# Altium schematic sheet Heater 020305.SchDoc
size A4
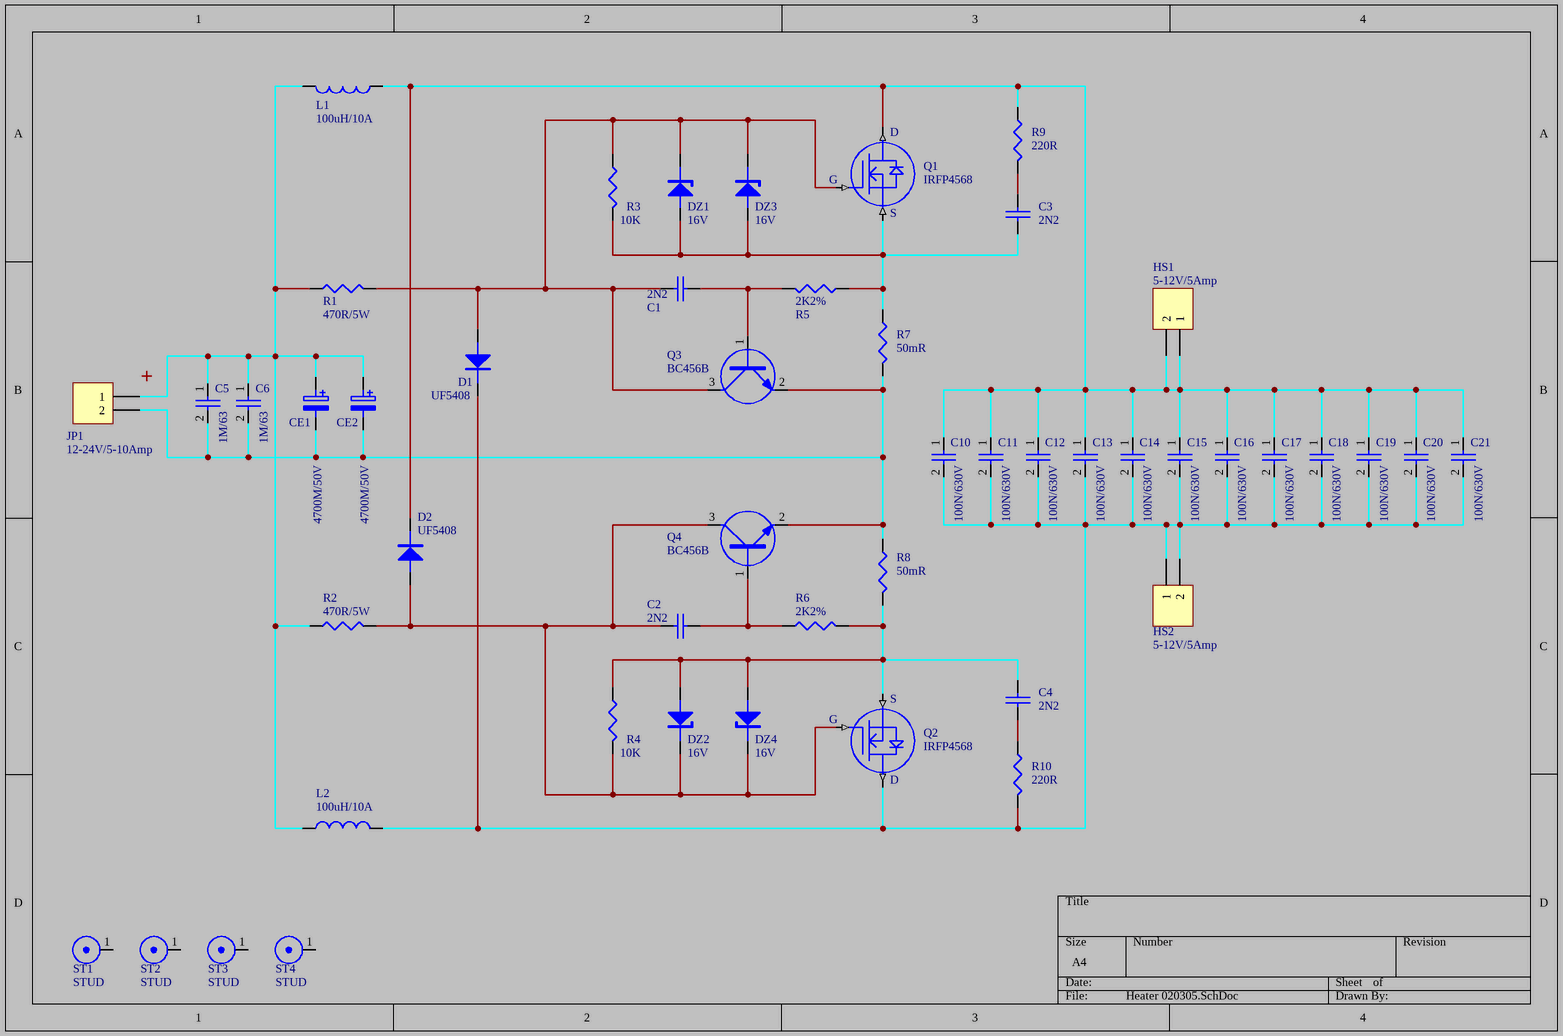
[diagram p0: Heater 020305.SchDoc]

## Parts
C1  2N2  [C2P]
C2  2N2  [C2P]
C3  2N2  [C2P]
C4  2N2  [C2P]
C5  1M/63  [C3P]
C6  1M/63  [C3P]
C10  100N/630V  [CV25-8-22]
C11  100N/630V  [CV25-8-22]
C12  100N/630V  [CV25-8-22]
C13  100N/630V  [CV25-8-22]
C14  100N/630V  [CV25-8-22]
C15  100N/630V  [CV25-8-22]
C16  100N/630V  [CV25-8-22]
C17  100N/630V  [CV25-8-22]
C18  100N/630V  [CV25-8-22]
C19  100N/630V  [CV25-8-22]
C20  100N/630V  [CV25-8-22]
C21  100N/630V  [CV25-8-22]
CE1  4700M/50V  [CAP3P]
CE2  4700M/50V  [CAP3P]
D1  UF5408  [D54]
D2  UF5408  [D54]
DZ1  16V  [D4P]
DZ2  16V  [D4P]
DZ3  16V  [D4P]
DZ4  16V  [D4P]
HS1  5-12V/5Amp  [HS1]
HS2  5-12V/5Amp  [HS1]
JP1  12-24V/5-10Amp  [DG55X2]
L1  100uH/10A  [INDU2511]
L2  100uH/10A  [INDU2511]
Q1  IRFP4568  [TO247-MOSPIN]
Q2  IRFP4568  [TO247-MOSPIN]
Q3  BC456B  [CBE-BC546]
Q4  BC456B  [CBE-BC546]
R1  470R/5W  [W5]
R2  470R/5W  [W5]
R3  10K  [R4P]
R4  10K  [R4P]
R5  2K2%  [R4P]
R6  2K2%  [R4P]
R7  50mR  [WIRE1m5]
R8  50mR  [WIRE1m5]
R9  220R  [W5]
R10  220R  [W5]
ST1  STUD  [CORNER]
ST2  STUD  [CORNER]
ST3  STUD  [CORNER]
ST4  STUD  [CORNER]

## Nets
NetC1_1: C1.1 Q3.1(B) R5.2
NetC1_2: C1.2 D1.1(A) DZ1.2(K) DZ3.2(K) Q1.1(G) Q3.3(C) R1.2 R3.1
NetC2_1: C2.1 Q4.1(B) R6.2
NetC2_2: C2.2 D2.1(A) DZ2.2(K) DZ4.2(K) Q2.1(G) Q4.3(C) R2.2 R4.2
NetC3_1: C3.1 R9.1
NetC3_2: C3.2 DZ1.1(A) DZ3.1(A) Q1.3(S) R3.2 R5.1 R7.1
NetC4_1: C4.1 R10.2
NetC4_2: C4.2 DZ2.1(A) DZ4.1(A) Q2.3(S) R4.1 R6.1 R8.1
NetC5_1: C5.1 C6.1 CE1.1 CE2.1 JP1.1 L1.1 L2.1 R1.1 R2.1
NetC5_2: C5.2 C6.2 CE1.2 CE2.2 JP1.2 Q3.2(E) Q4.2(E) R7.2 R8.2
NetC10_1: C10.1 C11.1 C12.1 C13.1 C14.1 C15.1 C16.1 C17.1 C18.1 C19.1 C20.1 C21.1 D2.2(K) HS1.1 HS1.2 L1.2 Q1.2(D) R9.2
NetC10_2: C10.2 C11.2 C12.2 C13.2 C14.2 C15.2 C16.2 C17.2 C18.2 C19.2 C20.2 C21.2 D1.2(K) HS2.1 HS2.2 L2.2 Q2.2(D) R10.1

Not connected (* = marked no-connect by the designer): ST1 1; ST2 1; ST3 1; ST4 1

## Notes on the sheet
- (near Q1) D
- (near Q1) G
- (near Q1) S
- (near JP1) +
- (near Q2) S
- (near Q2) G
- (near Q2) D

## Library data of the parts
C1-C6 C10-C21 = C
CE1 CE2 = E
D1 D2 = D: D4P: *
DZ1-DZ4 = DZ
HS1 HS2 JP1 = Header 2: Header, 2-Pin; LatestRevisionDate: 17-Jul-2002; LatestRevisionNote: Re-released for DXP Platform.; Publisher: Altium Limited
L1 L2 = INDUCTOR
Q1 Q2 = MOSFET N
Q3 Q4 = N
R1-R10 = R